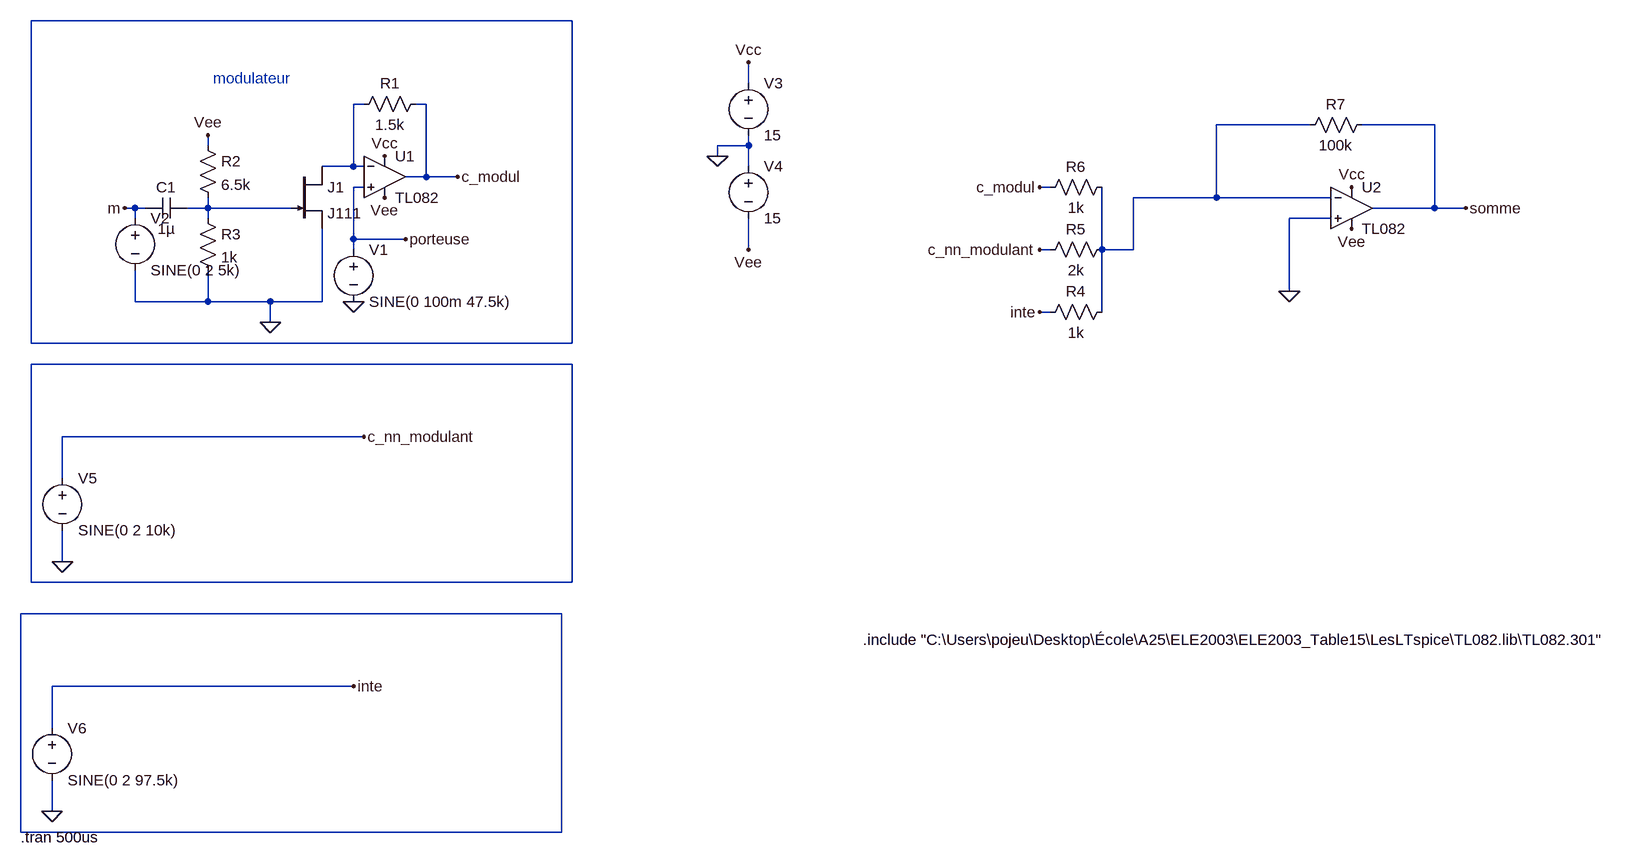
[diagram p0: schematic Sommateur.asc]
Sommateur.asc, the LTspice schematic file:
Version 4.1
SHEET 1 2232 1032
WIRE 512 -240 -320 -240
WIRE 784 -144 784 -176
WIRE 192 -112 176 -112
WIRE 288 -112 272 -112
WIRE 1648 -80 1504 -80
WIRE 1840 -80 1728 -80
WIRE -48 -48 -48 -64
WIRE 784 -48 784 -64
WIRE 784 -48 736 -48
WIRE 736 -32 736 -48
WIRE 176 -16 176 -112
WIRE 176 -16 128 -16
WIRE 192 -16 176 -16
WIRE 784 -16 784 -48
WIRE 288 0 288 -112
WIRE 288 0 256 0
WIRE 336 0 288 0
WIRE 192 16 176 16
WIRE 1248 16 1232 16
WIRE 1504 32 1504 -80
WIRE 1504 32 1376 32
WIRE 1680 32 1504 32
WIRE -160 48 -176 48
WIRE -144 48 -160 48
WIRE -48 48 -48 32
WIRE -48 48 -80 48
WIRE 80 48 -48 48
WIRE 1840 48 1840 -80
WIRE 1840 48 1744 48
WIRE 1888 48 1840 48
WIRE -160 64 -160 48
WIRE -48 64 -48 48
WIRE 1680 64 1616 64
WIRE 176 96 176 16
WIRE 256 96 176 96
WIRE 176 112 176 96
WIRE 784 112 784 64
WIRE 1248 112 1232 112
WIRE 1328 112 1328 16
WIRE 1376 112 1376 32
WIRE 1376 112 1328 112
WIRE 1616 176 1616 64
WIRE -160 192 -160 144
WIRE -48 192 -48 144
WIRE -48 192 -160 192
WIRE 48 192 -48 192
WIRE 128 192 128 80
WIRE 128 192 48 192
WIRE 1248 208 1232 208
WIRE 1328 208 1328 112
WIRE 48 224 48 192
WIRE -320 256 -320 -240
WIRE 512 256 512 -240
WIRE 512 256 -320 256
WIRE 512 288 -320 288
WIRE 192 400 -272 400
WIRE -272 464 -272 400
WIRE -272 592 -272 544
WIRE -320 624 -320 288
WIRE 512 624 512 288
WIRE 512 624 -320 624
WIRE 496 672 -336 672
WIRE 176 784 -288 784
WIRE -288 848 -288 784
WIRE -288 976 -288 928
WIRE -336 1008 -336 672
WIRE 496 1008 496 672
WIRE 496 1008 -336 1008
FLAG 224 32 Vee
FLAG 224 -32 Vcc
FLAG 336 0 c_modul
FLAG 176 192 0
FLAG 256 96 porteuse
FLAG 48 224 0
FLAG -48 -64 Vee
FLAG -176 48 m
FLAG 1712 80 Vee
FLAG 1712 16 Vcc
FLAG 736 -32 0
FLAG 784 112 Vee
FLAG 784 -176 Vcc
FLAG 1616 176 0
FLAG 1232 16 c_modul
FLAG 1232 112 c_nn_modulant
FLAG 1232 208 inte
FLAG 1888 48 somme
FLAG -272 592 0
FLAG 192 400 c_nn_modulant
FLAG -288 976 0
FLAG 176 784 inte
SYMBOL OpAmps\\opamp2 224 -64 R0
SYMATTR InstName U1
SYMATTR Value TL082
SYMBOL res 288 -128 R90
WINDOW 0 0 56 VBottom 2
WINDOW 3 32 56 VTop 2
SYMATTR InstName R1
SYMATTR Value 1.5k
SYMBOL res -64 -64 R0
SYMATTR InstName R2
SYMATTR Value 6.5k
SYMBOL res -64 48 R0
SYMATTR InstName R3
SYMATTR Value 1k
SYMBOL njf 80 -16 R0
SYMATTR InstName J1
SYMATTR Value J111
SYMBOL voltage 176 96 R0
WINDOW 123 0 0 Left 0
WINDOW 39 0 0 Left 0
SYMATTR InstName V1
SYMATTR Value SINE(0 100m 47.5k)
SYMBOL cap -80 32 R90
WINDOW 0 0 32 VBottom 2
WINDOW 3 32 32 VTop 2
SYMATTR InstName C1
SYMATTR Value 1µ
SYMBOL voltage -160 48 R0
WINDOW 123 0 0 Left 0
WINDOW 39 0 0 Left 0
SYMATTR InstName V2
SYMATTR Value SINE(0 2 5k)
SYMBOL OpAmps\\opamp2 1712 -16 R0
SYMATTR InstName U2
SYMATTR Value TL082
SYMBOL voltage 784 -160 R0
WINDOW 123 0 0 Left 0
WINDOW 39 0 0 Left 0
SYMATTR InstName V3
SYMATTR Value 15
SYMBOL voltage 784 -32 R0
WINDOW 123 0 0 Left 0
WINDOW 39 0 0 Left 0
SYMATTR InstName V4
SYMATTR Value 15
SYMBOL voltage -272 448 R0
WINDOW 123 0 0 Left 0
WINDOW 39 0 0 Left 0
SYMATTR InstName V5
SYMATTR Value SINE(0 2 10k)
SYMBOL voltage -288 832 R0
WINDOW 123 0 0 Left 0
WINDOW 39 0 0 Left 0
SYMATTR InstName V6
SYMATTR Value SINE(0 2 97.5k)
SYMBOL res 1344 192 R90
WINDOW 0 0 56 VBottom 2
WINDOW 3 32 56 VTop 2
SYMATTR InstName R4
SYMATTR Value 1k
SYMBOL res 1344 96 R90
WINDOW 0 0 56 VBottom 2
WINDOW 3 32 56 VTop 2
SYMATTR InstName R5
SYMATTR Value 2k
SYMBOL res 1344 0 R90
WINDOW 0 0 56 VBottom 2
WINDOW 3 32 56 VTop 2
SYMATTR InstName R6
SYMATTR Value 1k
SYMBOL res 1744 -96 R90
WINDOW 0 0 56 VBottom 2
WINDOW 3 32 56 VTop 2
SYMATTR InstName R7
SYMATTR Value 100k
TEXT -40 -152 Left 2 ;modulateur
TEXT 960 712 Left 2 !.include "C:\\Users\\pojeu\\Desktop\\École\\A25\\ELE2003\\ELE2003_Table15\\LesLTspice\\TL082.lib\\TL082.301"
TEXT -336 1016 Left 2 !.tran 500us

The netlist it stands for:
* Sommateur.asc
X§U1 porteuse N002 Vcc Vee c_modul TL082  ; pins In+ In- V+ V- OUT
R1 c_modul N002 1.5k
R2 Vee N004 6.5k
R3 N004 0 1k
J1 N002 N004 0 J111
V1 porteuse 0 SINE(0 100m 47.5k)
C1 N004 m 1µ
V2 m 0 SINE(0 2 5k)
X§U2 0 N003 Vcc Vee somme TL082  ; pins In+ In- V+ V- OUT
V3 Vcc 0 15
V4 0 Vee 15
V5 c_nn_modulant 0 SINE(0 2 10k)
V6 inte 0 SINE(0 2 97.5k)
R4 N003 inte 1k
R5 N003 c_nn_modulant 2k
R6 N003 c_modul 1k
R7 somme N003 100k
.model NJF NJF
.model PJF PJF
.lib standard.jft
* modulateur
.include "C:\Users\pojeu\Desktop\École\A25\ELE2003\ELE2003_Table15\LesLTspice\TL082.lib\TL082.301"
.tran 500us
.backanno
.end